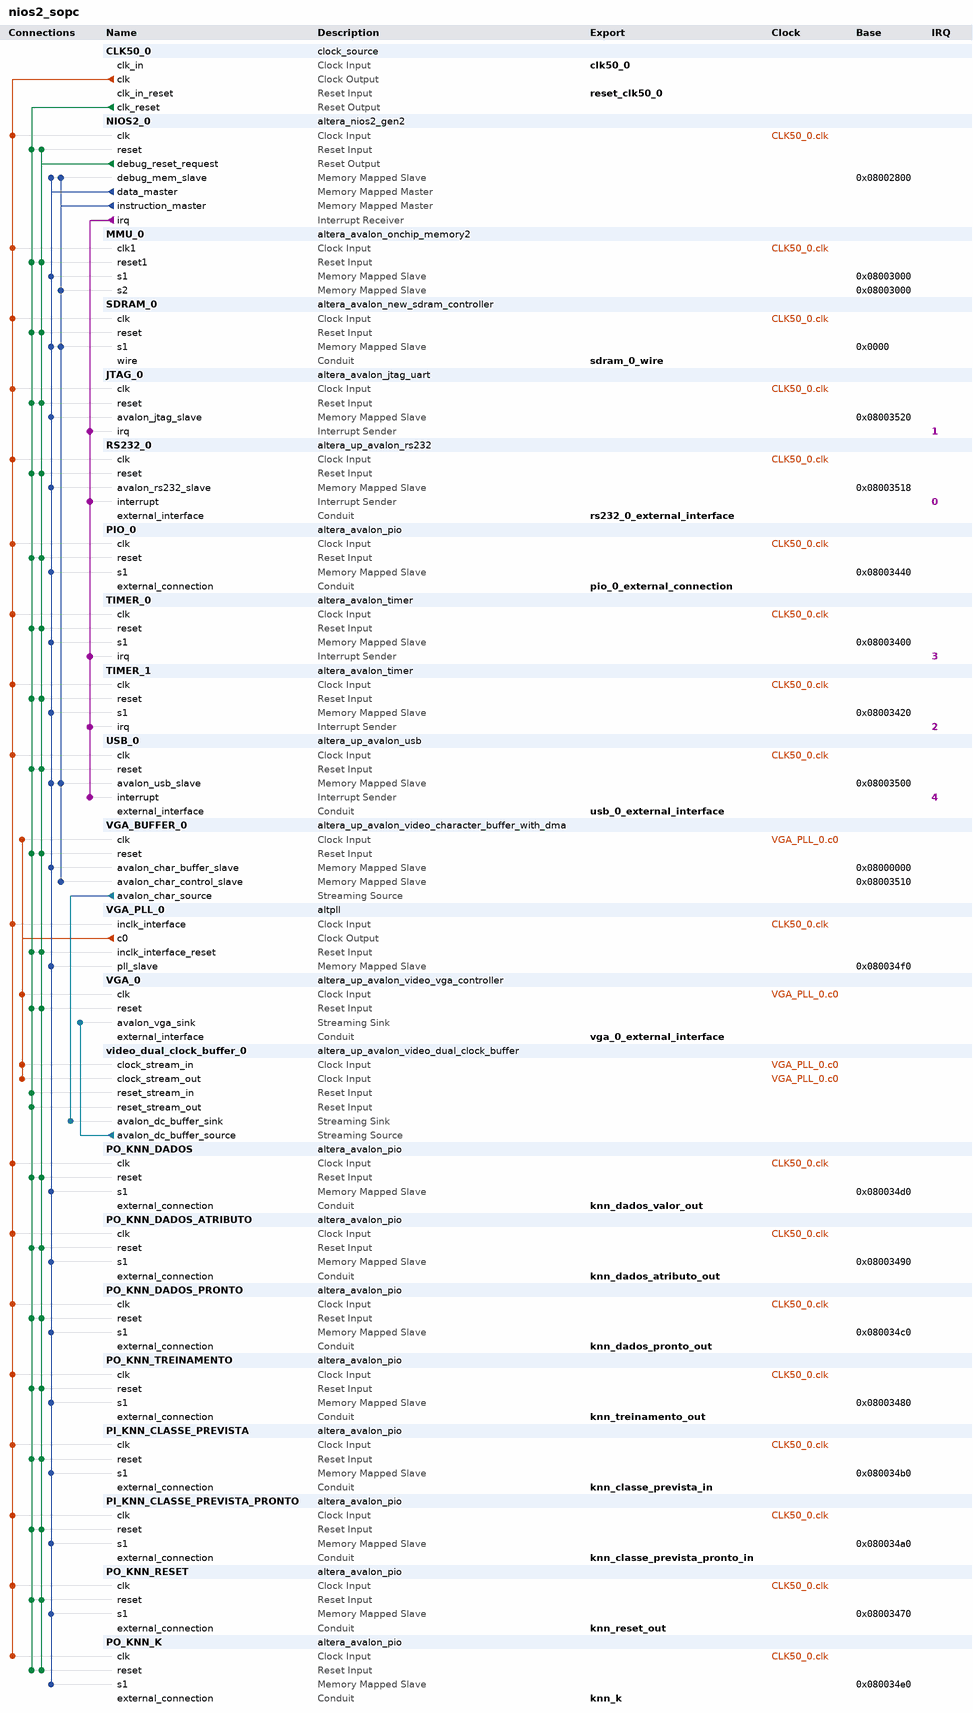
[diagram p0: system contents]
# Platform Designer (Qsys) system nios2_sopc, Cyclone IV E EP4CE115F29C7
# Parameters at their usual value, and those the tool derives, are not listed.
package require -exact qsys 18.1
create_system nios2_sopc
set_project_property DEVICE_FAMILY {Cyclone IV E}
set_project_property DEVICE EP4CE115F29C7

add_instance CLK50_0 clock_source 18.1
set_instance_parameter_value CLK50_0 clockFrequency 50000000

add_instance NIOS2_0 altera_nios2_gen2 18.1
set_instance_parameter_value NIOS2_0 dcache_size 2048
set_instance_parameter_value NIOS2_0 dividerType srt2
set_instance_parameter_value NIOS2_0 exceptionSlave SDRAM_0.s1
set_instance_parameter_value NIOS2_0 icache_size 4096
set_instance_parameter_value NIOS2_0 impl Fast
set_instance_parameter_value NIOS2_0 mmu_TLBMissExcSlave MMU_0.s2
set_instance_parameter_value NIOS2_0 mmu_enabled true
set_instance_parameter_value NIOS2_0 resetSlave SDRAM_0.s1

add_instance MMU_0 altera_avalon_onchip_memory2 18.1
set_instance_parameter_value MMU_0 dataWidth 32
set_instance_parameter_value MMU_0 dualPort true
set_instance_parameter_value MMU_0 initMemContent true
set_instance_parameter_value MMU_0 initializationFileName onchip_mem.hex
set_instance_parameter_value MMU_0 memorySize 1024
set_instance_parameter_value MMU_0 singleClockOperation true

add_instance SDRAM_0 altera_avalon_new_sdram_controller 18.1
set_instance_parameter_value SDRAM_0 TAC 5.5
set_instance_parameter_value SDRAM_0 TRCD 20.0
set_instance_parameter_value SDRAM_0 TRP 20.0
set_instance_parameter_value SDRAM_0 casLatency 3
set_instance_parameter_value SDRAM_0 columnWidth 10
set_instance_parameter_value SDRAM_0 dataWidth 32
set_instance_parameter_value SDRAM_0 generateSimulationModel false
set_instance_parameter_value SDRAM_0 model single_Micron_MT48LC4M32B2_7_chip
set_instance_parameter_value SDRAM_0 numberOfBanks 4
set_instance_parameter_value SDRAM_0 numberOfChipSelects 1
set_instance_parameter_value SDRAM_0 powerUpDelay 100.0
set_instance_parameter_value SDRAM_0 refreshPeriod 15.625
set_instance_parameter_value SDRAM_0 rowWidth 13

add_instance JTAG_0 altera_avalon_jtag_uart 18.1
set_instance_parameter_value JTAG_0 simInteractiveOptions NO_INTERACTIVE_WINDOWS

add_instance RS232_0 altera_up_avalon_rs232 17.1
set_instance_parameter_value RS232_0 baud 115200
set_instance_parameter_value RS232_0 parity None

add_instance PIO_0 altera_avalon_pio 18.1
set_instance_parameter_value PIO_0 bitModifyingOutReg true
set_instance_parameter_value PIO_0 direction Output
set_instance_parameter_value PIO_0 width 8

add_instance TIMER_0 altera_avalon_timer 18.1
set_instance_parameter_value TIMER_0 period 1
set_instance_parameter_value TIMER_0 periodUnits MSEC

add_instance TIMER_1 altera_avalon_timer 18.1
set_instance_parameter_value TIMER_1 period 1
set_instance_parameter_value TIMER_1 periodUnits MSEC

add_instance USB_0 altera_up_avalon_usb 18.0

add_instance VGA_BUFFER_0 altera_up_avalon_video_character_buffer_with_dma 18.0
set_instance_parameter_value VGA_BUFFER_0 enable_transparency false

add_instance VGA_PLL_0 altpll 18.1
set_instance_parameter_value VGA_PLL_0 CLK0_DIVIDE_BY 2
set_instance_parameter_value VGA_PLL_0 CLK0_MULTIPLY_BY 1
set_instance_parameter_value VGA_PLL_0 INCLK0_INPUT_FREQUENCY 20000
set_instance_parameter_value VGA_PLL_0 PORT_ARESET PORT_UNUSED
set_instance_parameter_value VGA_PLL_0 PORT_LOCKED PORT_UNUSED
set_instance_parameter_value VGA_PLL_0 PORT_clk1 PORT_UNUSED
set_instance_parameter_value VGA_PLL_0 PORT_clk2 PORT_UNUSED
set_instance_parameter_value VGA_PLL_0 PORT_clk3 PORT_UNUSED

add_instance VGA_0 altera_up_avalon_video_vga_controller 18.0
set_instance_parameter_value VGA_0 board DE2-115
set_instance_parameter_value VGA_0 resolution {VGA 640x480}

add_instance video_dual_clock_buffer_0 altera_up_avalon_video_dual_clock_buffer 18.0
set_instance_parameter_value video_dual_clock_buffer_0 color_bits 10

add_instance PO_KNN_DADOS altera_avalon_pio 18.1
set_instance_parameter_value PO_KNN_DADOS direction Output
set_instance_parameter_value PO_KNN_DADOS width 16

add_instance PO_KNN_DADOS_ATRIBUTO altera_avalon_pio 18.1
set_instance_parameter_value PO_KNN_DADOS_ATRIBUTO direction Output
set_instance_parameter_value PO_KNN_DADOS_ATRIBUTO width 8

add_instance PO_KNN_DADOS_PRONTO altera_avalon_pio 18.1
set_instance_parameter_value PO_KNN_DADOS_PRONTO direction Output
set_instance_parameter_value PO_KNN_DADOS_PRONTO width 1

add_instance PO_KNN_TREINAMENTO altera_avalon_pio 18.1
set_instance_parameter_value PO_KNN_TREINAMENTO direction Output
set_instance_parameter_value PO_KNN_TREINAMENTO width 1

add_instance PI_KNN_CLASSE_PREVISTA altera_avalon_pio 18.1
set_instance_parameter_value PI_KNN_CLASSE_PREVISTA direction Input
set_instance_parameter_value PI_KNN_CLASSE_PREVISTA width 16

add_instance PI_KNN_CLASSE_PREVISTA_PRONTO altera_avalon_pio 18.1
set_instance_parameter_value PI_KNN_CLASSE_PREVISTA_PRONTO direction Input
set_instance_parameter_value PI_KNN_CLASSE_PREVISTA_PRONTO width 1

add_instance PO_KNN_RESET altera_avalon_pio 18.1
set_instance_parameter_value PO_KNN_RESET direction Output
set_instance_parameter_value PO_KNN_RESET width 1

add_instance PO_KNN_K altera_avalon_pio 18.1
set_instance_parameter_value PO_KNN_K direction Output
set_instance_parameter_value PO_KNN_K width 5

# connections
add_connection CLK50_0.clk JTAG_0.clk clock
add_connection CLK50_0.clk MMU_0.clk1 clock
add_connection CLK50_0.clk NIOS2_0.clk clock
add_connection CLK50_0.clk PI_KNN_CLASSE_PREVISTA.clk clock
add_connection CLK50_0.clk PI_KNN_CLASSE_PREVISTA_PRONTO.clk clock
add_connection CLK50_0.clk PIO_0.clk clock
add_connection CLK50_0.clk PO_KNN_DADOS.clk clock
add_connection CLK50_0.clk PO_KNN_DADOS_ATRIBUTO.clk clock
add_connection CLK50_0.clk PO_KNN_DADOS_PRONTO.clk clock
add_connection CLK50_0.clk PO_KNN_K.clk clock
add_connection CLK50_0.clk PO_KNN_RESET.clk clock
add_connection CLK50_0.clk PO_KNN_TREINAMENTO.clk clock
add_connection CLK50_0.clk RS232_0.clk clock
add_connection CLK50_0.clk SDRAM_0.clk clock
add_connection CLK50_0.clk TIMER_0.clk clock
add_connection CLK50_0.clk TIMER_1.clk clock
add_connection CLK50_0.clk USB_0.clk clock
add_connection CLK50_0.clk VGA_PLL_0.inclk_interface clock
add_connection VGA_PLL_0.c0 VGA_0.clk clock
add_connection VGA_PLL_0.c0 VGA_BUFFER_0.clk clock
add_connection VGA_PLL_0.c0 video_dual_clock_buffer_0.clock_stream_in clock
add_connection VGA_PLL_0.c0 video_dual_clock_buffer_0.clock_stream_out clock
add_connection CLK50_0.clk_reset JTAG_0.reset reset
add_connection CLK50_0.clk_reset MMU_0.reset1 reset
add_connection CLK50_0.clk_reset NIOS2_0.reset reset
add_connection CLK50_0.clk_reset PI_KNN_CLASSE_PREVISTA.reset reset
add_connection CLK50_0.clk_reset PI_KNN_CLASSE_PREVISTA_PRONTO.reset reset
add_connection CLK50_0.clk_reset PIO_0.reset reset
add_connection CLK50_0.clk_reset PO_KNN_DADOS.reset reset
add_connection CLK50_0.clk_reset PO_KNN_DADOS_ATRIBUTO.reset reset
add_connection CLK50_0.clk_reset PO_KNN_DADOS_PRONTO.reset reset
add_connection CLK50_0.clk_reset PO_KNN_K.reset reset
add_connection CLK50_0.clk_reset PO_KNN_RESET.reset reset
add_connection CLK50_0.clk_reset PO_KNN_TREINAMENTO.reset reset
add_connection CLK50_0.clk_reset RS232_0.reset reset
add_connection CLK50_0.clk_reset SDRAM_0.reset reset
add_connection CLK50_0.clk_reset TIMER_0.reset reset
add_connection CLK50_0.clk_reset TIMER_1.reset reset
add_connection CLK50_0.clk_reset USB_0.reset reset
add_connection CLK50_0.clk_reset VGA_0.reset reset
add_connection CLK50_0.clk_reset VGA_BUFFER_0.reset reset
add_connection CLK50_0.clk_reset VGA_PLL_0.inclk_interface_reset reset
add_connection CLK50_0.clk_reset video_dual_clock_buffer_0.reset_stream_in reset
add_connection CLK50_0.clk_reset video_dual_clock_buffer_0.reset_stream_out reset
add_connection NIOS2_0.debug_reset_request JTAG_0.reset reset
add_connection NIOS2_0.debug_reset_request MMU_0.reset1 reset
add_connection NIOS2_0.debug_reset_request NIOS2_0.reset reset
add_connection NIOS2_0.debug_reset_request PI_KNN_CLASSE_PREVISTA.reset reset
add_connection NIOS2_0.debug_reset_request PI_KNN_CLASSE_PREVISTA_PRONTO.reset reset
add_connection NIOS2_0.debug_reset_request PIO_0.reset reset
add_connection NIOS2_0.debug_reset_request PO_KNN_DADOS.reset reset
add_connection NIOS2_0.debug_reset_request PO_KNN_DADOS_ATRIBUTO.reset reset
add_connection NIOS2_0.debug_reset_request PO_KNN_DADOS_PRONTO.reset reset
add_connection NIOS2_0.debug_reset_request PO_KNN_K.reset reset
add_connection NIOS2_0.debug_reset_request PO_KNN_RESET.reset reset
add_connection NIOS2_0.debug_reset_request PO_KNN_TREINAMENTO.reset reset
add_connection NIOS2_0.debug_reset_request RS232_0.reset reset
add_connection NIOS2_0.debug_reset_request SDRAM_0.reset reset
add_connection NIOS2_0.debug_reset_request TIMER_0.reset reset
add_connection NIOS2_0.debug_reset_request TIMER_1.reset reset
add_connection NIOS2_0.debug_reset_request USB_0.reset reset
add_connection NIOS2_0.debug_reset_request VGA_0.reset reset
add_connection NIOS2_0.debug_reset_request VGA_BUFFER_0.reset reset
add_connection NIOS2_0.debug_reset_request VGA_PLL_0.inclk_interface_reset reset
add_connection NIOS2_0.data_master JTAG_0.avalon_jtag_slave avalon
set_connection_parameter_value NIOS2_0.data_master/JTAG_0.avalon_jtag_slave baseAddress 0x08003520
add_connection NIOS2_0.data_master MMU_0.s1 avalon
set_connection_parameter_value NIOS2_0.data_master/MMU_0.s1 baseAddress 0x08003000
add_connection NIOS2_0.data_master NIOS2_0.debug_mem_slave avalon
set_connection_parameter_value NIOS2_0.data_master/NIOS2_0.debug_mem_slave baseAddress 0x08002800
add_connection NIOS2_0.data_master PI_KNN_CLASSE_PREVISTA.s1 avalon
set_connection_parameter_value NIOS2_0.data_master/PI_KNN_CLASSE_PREVISTA.s1 baseAddress 0x080034b0
add_connection NIOS2_0.data_master PI_KNN_CLASSE_PREVISTA_PRONTO.s1 avalon
set_connection_parameter_value NIOS2_0.data_master/PI_KNN_CLASSE_PREVISTA_PRONTO.s1 baseAddress 0x080034a0
add_connection NIOS2_0.data_master PIO_0.s1 avalon
set_connection_parameter_value NIOS2_0.data_master/PIO_0.s1 baseAddress 0x08003440
add_connection NIOS2_0.data_master PO_KNN_DADOS.s1 avalon
set_connection_parameter_value NIOS2_0.data_master/PO_KNN_DADOS.s1 baseAddress 0x080034d0
add_connection NIOS2_0.data_master PO_KNN_DADOS_ATRIBUTO.s1 avalon
set_connection_parameter_value NIOS2_0.data_master/PO_KNN_DADOS_ATRIBUTO.s1 baseAddress 0x08003490
add_connection NIOS2_0.data_master PO_KNN_DADOS_PRONTO.s1 avalon
set_connection_parameter_value NIOS2_0.data_master/PO_KNN_DADOS_PRONTO.s1 baseAddress 0x080034c0
add_connection NIOS2_0.data_master PO_KNN_K.s1 avalon
set_connection_parameter_value NIOS2_0.data_master/PO_KNN_K.s1 baseAddress 0x080034e0
add_connection NIOS2_0.data_master PO_KNN_RESET.s1 avalon
set_connection_parameter_value NIOS2_0.data_master/PO_KNN_RESET.s1 baseAddress 0x08003470
add_connection NIOS2_0.data_master PO_KNN_TREINAMENTO.s1 avalon
set_connection_parameter_value NIOS2_0.data_master/PO_KNN_TREINAMENTO.s1 baseAddress 0x08003480
add_connection NIOS2_0.data_master RS232_0.avalon_rs232_slave avalon
set_connection_parameter_value NIOS2_0.data_master/RS232_0.avalon_rs232_slave baseAddress 0x08003518
add_connection NIOS2_0.data_master SDRAM_0.s1 avalon
set_connection_parameter_value NIOS2_0.data_master/SDRAM_0.s1 baseAddress 0x0000
add_connection NIOS2_0.data_master TIMER_0.s1 avalon
set_connection_parameter_value NIOS2_0.data_master/TIMER_0.s1 baseAddress 0x08003400
add_connection NIOS2_0.data_master TIMER_1.s1 avalon
set_connection_parameter_value NIOS2_0.data_master/TIMER_1.s1 baseAddress 0x08003420
add_connection NIOS2_0.data_master USB_0.avalon_usb_slave avalon
set_connection_parameter_value NIOS2_0.data_master/USB_0.avalon_usb_slave baseAddress 0x08003500
add_connection NIOS2_0.data_master VGA_BUFFER_0.avalon_char_buffer_slave avalon
set_connection_parameter_value NIOS2_0.data_master/VGA_BUFFER_0.avalon_char_buffer_slave baseAddress 0x08000000
add_connection NIOS2_0.data_master VGA_PLL_0.pll_slave avalon
set_connection_parameter_value NIOS2_0.data_master/VGA_PLL_0.pll_slave baseAddress 0x080034f0
add_connection NIOS2_0.instruction_master MMU_0.s2 avalon
set_connection_parameter_value NIOS2_0.instruction_master/MMU_0.s2 baseAddress 0x08003000
add_connection NIOS2_0.instruction_master NIOS2_0.debug_mem_slave avalon
set_connection_parameter_value NIOS2_0.instruction_master/NIOS2_0.debug_mem_slave baseAddress 0x08002800
add_connection NIOS2_0.instruction_master SDRAM_0.s1 avalon
set_connection_parameter_value NIOS2_0.instruction_master/SDRAM_0.s1 baseAddress 0x0000
add_connection NIOS2_0.instruction_master USB_0.avalon_usb_slave avalon
set_connection_parameter_value NIOS2_0.instruction_master/USB_0.avalon_usb_slave baseAddress 0x08003500
add_connection NIOS2_0.instruction_master VGA_BUFFER_0.avalon_char_control_slave avalon
set_connection_parameter_value NIOS2_0.instruction_master/VGA_BUFFER_0.avalon_char_control_slave baseAddress 0x08003510
add_connection VGA_BUFFER_0.avalon_char_source video_dual_clock_buffer_0.avalon_dc_buffer_sink avalon_streaming
add_connection video_dual_clock_buffer_0.avalon_dc_buffer_source VGA_0.avalon_vga_sink avalon_streaming
add_connection NIOS2_0.irq JTAG_0.irq interrupt
set_connection_parameter_value NIOS2_0.irq/JTAG_0.irq irqNumber 1
add_connection NIOS2_0.irq RS232_0.interrupt interrupt
set_connection_parameter_value NIOS2_0.irq/RS232_0.interrupt irqNumber 0
add_connection NIOS2_0.irq TIMER_0.irq interrupt
set_connection_parameter_value NIOS2_0.irq/TIMER_0.irq irqNumber 3
add_connection NIOS2_0.irq TIMER_1.irq interrupt
set_connection_parameter_value NIOS2_0.irq/TIMER_1.irq irqNumber 2
add_connection NIOS2_0.irq USB_0.interrupt interrupt
set_connection_parameter_value NIOS2_0.irq/USB_0.interrupt irqNumber 4

# exported interfaces
add_interface clk50_0 clock sink
set_interface_property clk50_0 EXPORT_OF CLK50_0.clk_in
add_interface knn_classe_prevista_in conduit end
set_interface_property knn_classe_prevista_in EXPORT_OF PI_KNN_CLASSE_PREVISTA.external_connection
add_interface knn_classe_prevista_pronto_in conduit end
set_interface_property knn_classe_prevista_pronto_in EXPORT_OF PI_KNN_CLASSE_PREVISTA_PRONTO.external_connection
add_interface knn_dados_atributo_out conduit end
set_interface_property knn_dados_atributo_out EXPORT_OF PO_KNN_DADOS_ATRIBUTO.external_connection
add_interface knn_dados_pronto_out conduit end
set_interface_property knn_dados_pronto_out EXPORT_OF PO_KNN_DADOS_PRONTO.external_connection
add_interface knn_dados_valor_out conduit end
set_interface_property knn_dados_valor_out EXPORT_OF PO_KNN_DADOS.external_connection
add_interface knn_k conduit end
set_interface_property knn_k EXPORT_OF PO_KNN_K.external_connection
add_interface knn_reset_out conduit end
set_interface_property knn_reset_out EXPORT_OF PO_KNN_RESET.external_connection
add_interface knn_treinamento_out conduit end
set_interface_property knn_treinamento_out EXPORT_OF PO_KNN_TREINAMENTO.external_connection
add_interface pio_0_external_connection conduit end
set_interface_property pio_0_external_connection EXPORT_OF PIO_0.external_connection
add_interface reset_clk50_0 reset sink
set_interface_property reset_clk50_0 EXPORT_OF CLK50_0.clk_in_reset
add_interface rs232_0_external_interface conduit end
set_interface_property rs232_0_external_interface EXPORT_OF RS232_0.external_interface
add_interface sdram_0_wire conduit end
set_interface_property sdram_0_wire EXPORT_OF SDRAM_0.wire
add_interface usb_0_external_interface conduit end
set_interface_property usb_0_external_interface EXPORT_OF USB_0.external_interface
add_interface vga_0_external_interface conduit end
set_interface_property vga_0_external_interface EXPORT_OF VGA_0.external_interface

set_interconnect_requirement {$system} qsys_mm.clockCrossingAdapter HANDSHAKE
set_interconnect_requirement {$system} qsys_mm.enableEccProtection FALSE
set_interconnect_requirement {$system} qsys_mm.insertDefaultSlave FALSE
set_interconnect_requirement {$system} qsys_mm.maxAdditionalLatency 1

save_system nios2_sopc.qsys
